# Altium project DCDCDC.PrjPcb
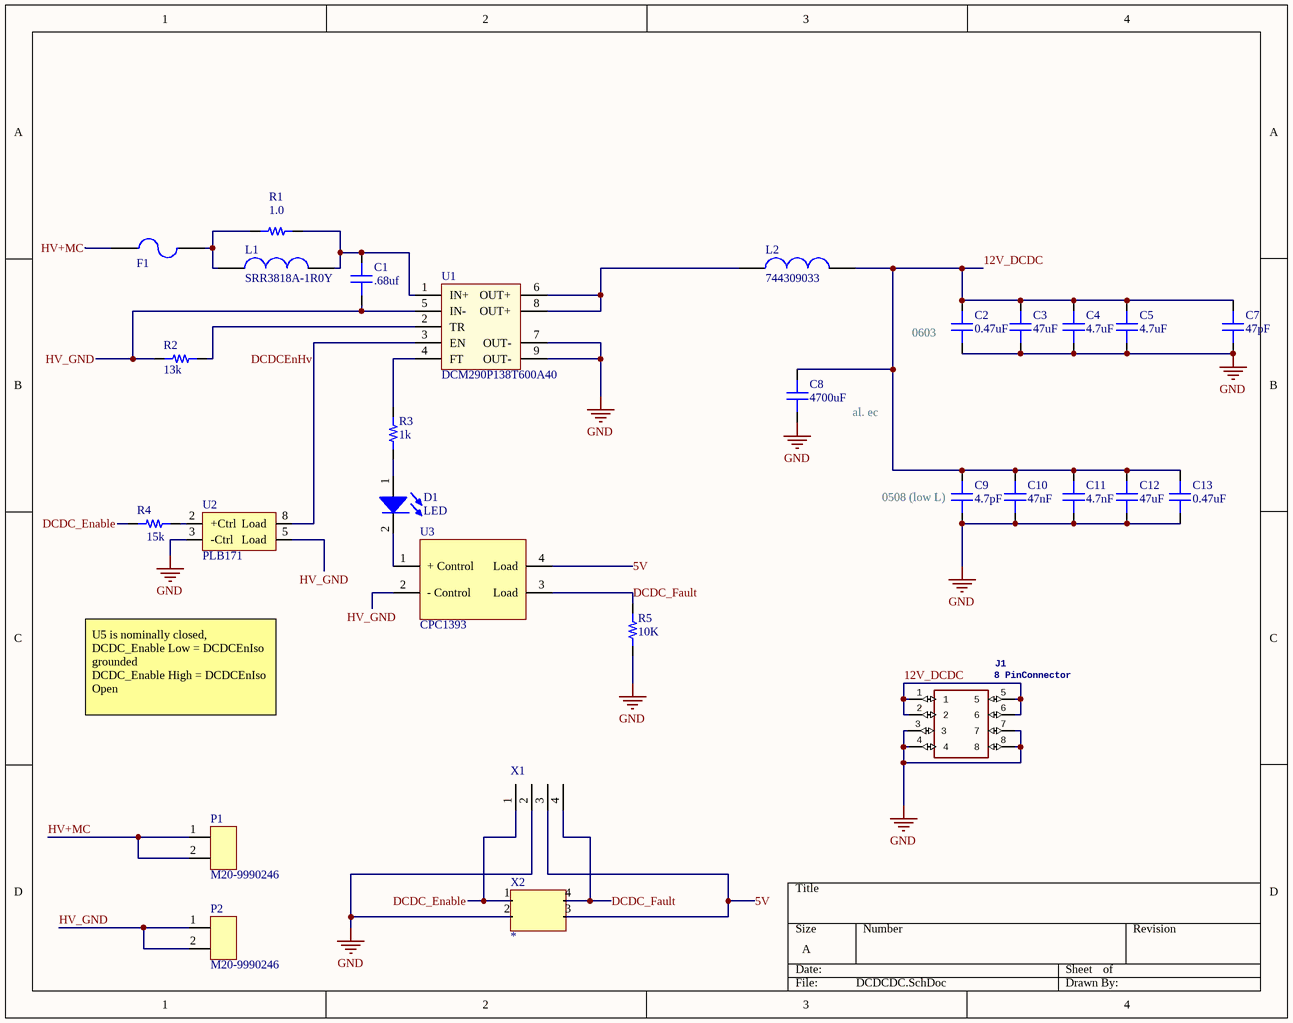
[diagram p0: DCDCDC.SchDoc]
1 sheet, 29 parts. Net scope: global (net labels, ports and power ports of the same name join across sheets).
Board file: PCB1.PcbDoc

## Sheet DCDCDC.SchDoc
size A

### Parts
C1  value .68uf  [ECW-FD2W684K-TH-CAP]  (hidden comment: HV Cap)
C2  capacitance: 0.47uF  [0603]  (hidden comment: capacitor)
C3  capacitance: 47uF  [0603]  (hidden comment: capacitor)
C4  capacitance: 4.7uF  [0603]  (hidden comment: capacitor)
C5  capacitance: 4.7uF  [0603]  (hidden comment: capacitor)
C7  capacitance: 47pF  [0603]  (hidden comment: capacitor)
C8  capacitance: 4700uF  [CAP AL TH D16 L7.5 H16.5]  (hidden comment: capacitor)
C9  capacitance: 4.7pF  [0508]  (hidden comment: capacitor)
C10  capacitance: 47nF  [0508]  (hidden comment: capacitor)
C11  capacitance: 4.7nF  [0508]  (hidden comment: capacitor)
C12  capacitance: 47uF  [0508]  (hidden comment: capacitor)
C13  capacitance: 0.47uF  [0508]  (hidden comment: capacitor)
D1  LED  [0805_LED]
F1  Fuse  [0885004.DR]  (value not drawn)
J1  8 PinConnector  [39-30-0080]
L1  SRR3818A-1R0Y  [SRR3818A-1R0Y]
L2  744309033  [744309033]
P1  M20-9990246  [M20-9990246]
P2  M20-9990246  [M20-9990246]
R1  value 1.0  [RES 0603/1608]  (hidden comment: Resistor 1.0 0603 1/10W 1%)
R2  value 13k  [RES 0603/1608]  (hidden comment: Resistor 13k 0603 1/10W 1%)
R3  value 1k  [RES 0603/1608]  (hidden comment: Resistor 330 0603 1/10W 1%)
R4  value 15k  [RES 0603/1608]  (hidden comment: Resistor 3.0k 0603 1/10W 1%)
R5  10K  [RES 0603/1608]
U1  DCM290P138T600A40  [DCM290P138T600A40]
U2  PLB171  [PLB171P]
U3  CPC1393  [CPC1393GR]
X1  4 pin header  [4pinheader]  (value not drawn)
X2  *  [Molex_43650_0402]

### Nets
GND: C2.1 C3.1 C4.1 C5.1 C7.1 C8.1 C9.1 C10.1 C11.1 C12.1 C13.1 J1.3 J1.4 J1.7 J1.8 R5.1 U1.7(OUT-) U1.9(OUT-) U2.3(-Ctrl) X1.2 X2.2
5V: U3.4(Load) X1.3 X2.3
12V_DCDC: C2.2 C3.2 C4.2 C5.2 C7.2 C8.2 C9.2 C10.2 C11.2 C12.2 C13.2 J1.1 J1.2 J1.5 J1.6 L2.2
DCDC_Enable: R4.1 X1.1 X2.1
DCDC_Fault: R5.2 U3.3(Load) X1.4 X2.4
DCDCEnHv: U1.3(EN) U2.8(Load)
HV+MC: F1.2 P1.1 P1.2
HV_GND: C1.2 P2.1 P2.2 R2.2 U1.5(IN-) U2.5(Load) U3.2(-_Control)
NetC1_1: C1.1 L1.2 R1.2 U1.1(IN+)
NetD1_1: D1.1(A) R3.1
NetD1_2: D1.2(K) U3.1(+_Control)
NetF1_1: F1.1 L1.1 R1.1
NetL2_1: L2.1 U1.6(OUT+) U1.8(OUT+)
NetR2_1: R2.1 U1.2(TR)
NetR3_2: R3.2 U1.4(FT)
NetR4_2: R4.2 U2.2(+Ctrl)

### Notes on the sheet
- (near C2) 0603
- (near C8) al. ec
- (near C9) 0508 (low L)
- U5 is nominally closed,
  DCDC_Enable Low = DCDCEnIso grounded
  DCDC_Enable High = DCDCEnIso Open

### Library data of the parts
C1 = 1082: Manufacturer_id: 1; MfrPartNo: ECW-FD2W684K; idCapacitor: 1082; Name: Cap_.68uf_450V_CAP TH; Voltage_Rating: 450V; Dielectric: Polypropylene; Tolerance: 10%; Created_By: Angel Delgado; Drawer_id: 1; Package: TH; Link: https://www.mouser.com/ProductDetail/Panasonic/ECW-FD2W684K?qs=sGAEpiMZZMsh%252b1woXyUXj8Oz95SkSMnKDNbVTfkAU30%3d; ComponentLink1Description: Datasheet
C2-C5 C7 = 1: Generic 0603 capacitor; id: 1; voltage: 50; dielectric: Ceramic; percent tolerance: 10; name: 0603 Capacitor; ESR: 1; package: 0603; quantity: 0
C8 = 8: Generic D16 L7.5 H16.5 capacitor; id: 8; voltage: 0; dielectric: Ceramic; updatedby: Eric Tse; name: CAP AL TH D16 L7.5 H16.5; percent tolerance: 0; ESR: 0; package: CAP AL TH D16 L7.5 H16.5; quantity: 0; createdby: Eric Tse; createddate: 11/22/2019 10:59:57 PM; updateddate: 11/22/2019 10:59:57 PM
C9-C13 = 7: generic 0508 capacitor; id: 7; voltage: 0; dielectric: Ceramic; updatedby: Eric Tse; name: 0508 Capacitor; percent tolerance: 0; ESR: 0; package: 0508; quantity: 0; link: https://www.digikey.com/product-detail/en/murata-electronics/LLL216R71E104MA01L/490-4346-2-ND/1022298; createdby: Eric Tse; createddate: 11/22/2019 10:07:42 PM; updateddate: 11/22/2019 10:07:42 PM
D1 = 1: idLED: 1; Name: LED_0805_RED; Value: Red; Vf: 0.7V; Manufacturer_id: 1; Drawer_id: 1; Package: 0805
F1 = 7: id: 7; itrip: 0; vmax: 450; Name: 0885004.DR; iinterrupt: 0; quantity: 0; link: https://www.digikey.com/product-detail/en/littelfuse-inc/0885004.DR/F10991CT-ND/8345705
J1 = 39: Connector Header Through Hole, Right Angle 8; Manufacturer_Name: Molex; GateName_1: G$1; Allied_Number: 70191047; id: 39; SymbolName_1: 39-30-0080; LibraryName: 39-30-0080; DeviceSetName: 39-30-0080; Package: 39-30-0080_1; RS_Part_Number: 6795852P; RS_Price-Stock: http://uk.rs-online.com/web/p/products/6795852P; Manufacturer_Part_Number: 39-30-0080; Height: mm
L1 = 4: 1uH fixed inductor; Manufacturer_id: 1; idInductor: 4; Created_By: Graydon; Drawer_id: 1; Name: SRR3818A-1R0Y; Value: 1uH; Package: Nonstandard; MfrPartNo: SRR3818A-1R0Y; Link: https://www.mouser.com/ProductDetail/Bourns/SRR3818A-1R0Y?qs=EU6FO9ffTwdCQ1wGwZI3iw%3D%3D; ComponentLink1Description: Mouser; ComponentLink1URL: https://www.mouser.com/ProductDetail/Bourns/SRR3818A-1R0Y?qs=EU6FO9ffTwdCQ1wGwZI3iw%3D%3D; Supplier1: Mouser; Supplier1PartNo: 652-SRR3818A-1R0Y; Created_Date: 11/12/2018
L2 = 3: 330nH wirewound inductor; Manufacturer_id: 1; idInductor: 3; Created_By: Graydon; Drawer_id: 1; Name: 744309033; Value: 330nH; Package: Nonstandard; MfrPartNo: 744309033; Link: https://www.digikey.com/product-detail/en/wurth-electronics-inc/744309033/732-3006-1-ND/2626130; Supplier1: Digikey; Supplier1PartNo: 732-3006-1-ND; Created_Date: 11/12/2018
P1 P2 = 25: 2 Pin VCC Power Header, Male; Manufacturer_id: 1; idConn: 25; Value: CONN; Voltage_Rating: Null; Num_Contacts: 2; Pitch: 2.54; Created_By: Austin; Drawer_id: 1; Name: M20-9990246; Num_Rows: Null; Package: Conn; MfrPartNo: M20-9990246; Link: https://www.digikey.com/product-detail/en/harwin-inc/M20-9990246/952-2262-ND/3728226; ComponentLink1Description: Null; ComponentLink1URL: https://www.digikey.com/product-detail/en/harwin-inc/M20-9990246/952-2262-ND/3728226; Supplier1: Digi-Key; Supplier1PartNo: 952-2262-ND; Created_Date: 12/15/2018; Updated_By: Null
R1 = 217: Manufacturer_id: 1; idResistor: 217; Name: Res_1.0_0603_1/10W_1%; Created_By: Nick Mah; Supplier 1: Digi-Key; Drawer_id: 1; Tolerance: 1%; Power: 1/10W; Package: 0603; ComponentLink1Description: Datasheet; Created_Date: 2018-10-20
R2 = 316: Manufacturer_id: 1; idResistor: 316; Name: Res_13k_0603_1/10W_1%; Created_By: Nick Mah; Supplier 1: Digi-Key; Drawer_id: 1; Tolerance: 1%; Power: 1/10W; Package: 0603; ComponentLink1Description: Datasheet; Created_Date: 2018-10-20
R3 = 277: Manufacturer_id: 1; idResistor: 277; Name: Res_330_0603_1/10W_1%; Created_By: Nick Mah; Supplier 1: Digi-Key; Drawer_id: 1; Tolerance: 1%; Power: 1/10W; Package: 0603; ComponentLink1Description: Datasheet; Created_Date: 2018-10-20
R4 = 300: Manufacturer_id: 1; idResistor: 300; Name: Res_3.0k_0603_1/10W_1%; Created_By: Nick Mah; Supplier 1: Digi-Key; Drawer_id: 1; Tolerance: 1%; Power: 1/10W; Package: 0603; ComponentLink1Description: Datasheet; Created_Date: 2018-10-20
R5 = 1: id: 1; name: 0603 Resistor; percent tolerance: 5; resistance: 10K; package: 0603; quantity: 0
U1 = 24: Vicor DC/DC converter; Manufacturer_id: 1; idIC_Misc: 24; Value: Null; Created_By: Graydon; Drawer_id: 1; Name: DCM290P138T600A40; Type: Null; Protocol: Null; Num_Circuits: 1; Data_Rate: Null; Vin(Min): Null; Vin(Max): Null; MfrPartNo: DCM290P138T600A40; Link: http://www.vicorpower.com/documents/datasheets/ds_DCM290y138x600A40.pdf; Supplier1: Digikey; Supplier1PartNo: 1102-5388-ND
U2 = 34: id: 34; name: PLB171P; package: PLB171P; quantity: 0
U3 = 26: Solid State Relay SPST-NO (1 Form A) 4-SMD (0.300", 7.62mm); Manufacturer_id: 1; MfrPartNo: CPC1393GRTR; idIC_Misc: 26; Value: Null; Created_By: Lynette; Drawer_id: 1; Name: CPC1393; Type: Null; Protocol: Null; Num_Circuits: 1; Data_Rate: Null; Vin(Min): Null; Vin(Max): Null; Package: CPC1393GR; Link: https://www.digikey.com/product-detail/en/ixys-integrated-circuits-division/CPC1393GRTR/CLA270CT-ND/1277144; ComponentLink1Description: Null; ComponentLink1URL: Null; Supplier1: Null; Supplier1PartNo: Null; Updated_By: Null
X1 = 40: id: 40; numcontacts: 4; numrows: 1; pitch: .1in; name: 4pinheader; quantity: 0; package: .1in
X2 = 6: Molex 43650_0402; id: 6; MfrPartNo: *